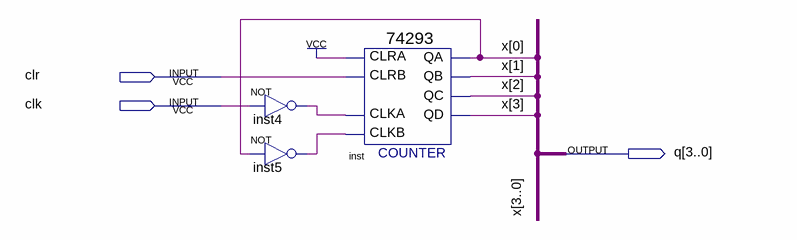
[diagram p0: schematic sheet]
// Quartus schematic Counter.bdf as structural Verilog: 3 symbols, 3 pins
module Counter (
  input  clr,
  input  clk,
  output [3:0] q
);

  wire inst4_out, inst5_out;

  not inst4 (inst4_out, clk);
  not inst5 (inst5_out, q[0]);
  \74293  inst (
    .CLKB(inst5_out), .CLRB(clr), .CLRA(1'b1), .CLKA(inst4_out), .QB(q[1]), .QC(q[2]), .QD(q[3]), .QA(q[0]));

  // Other names for the same wires on the sheet: x[3:0] = q
endmodule
